# EAGLE design logoi_smd_gndpln v0.1 (EAGLE 9.0.0)
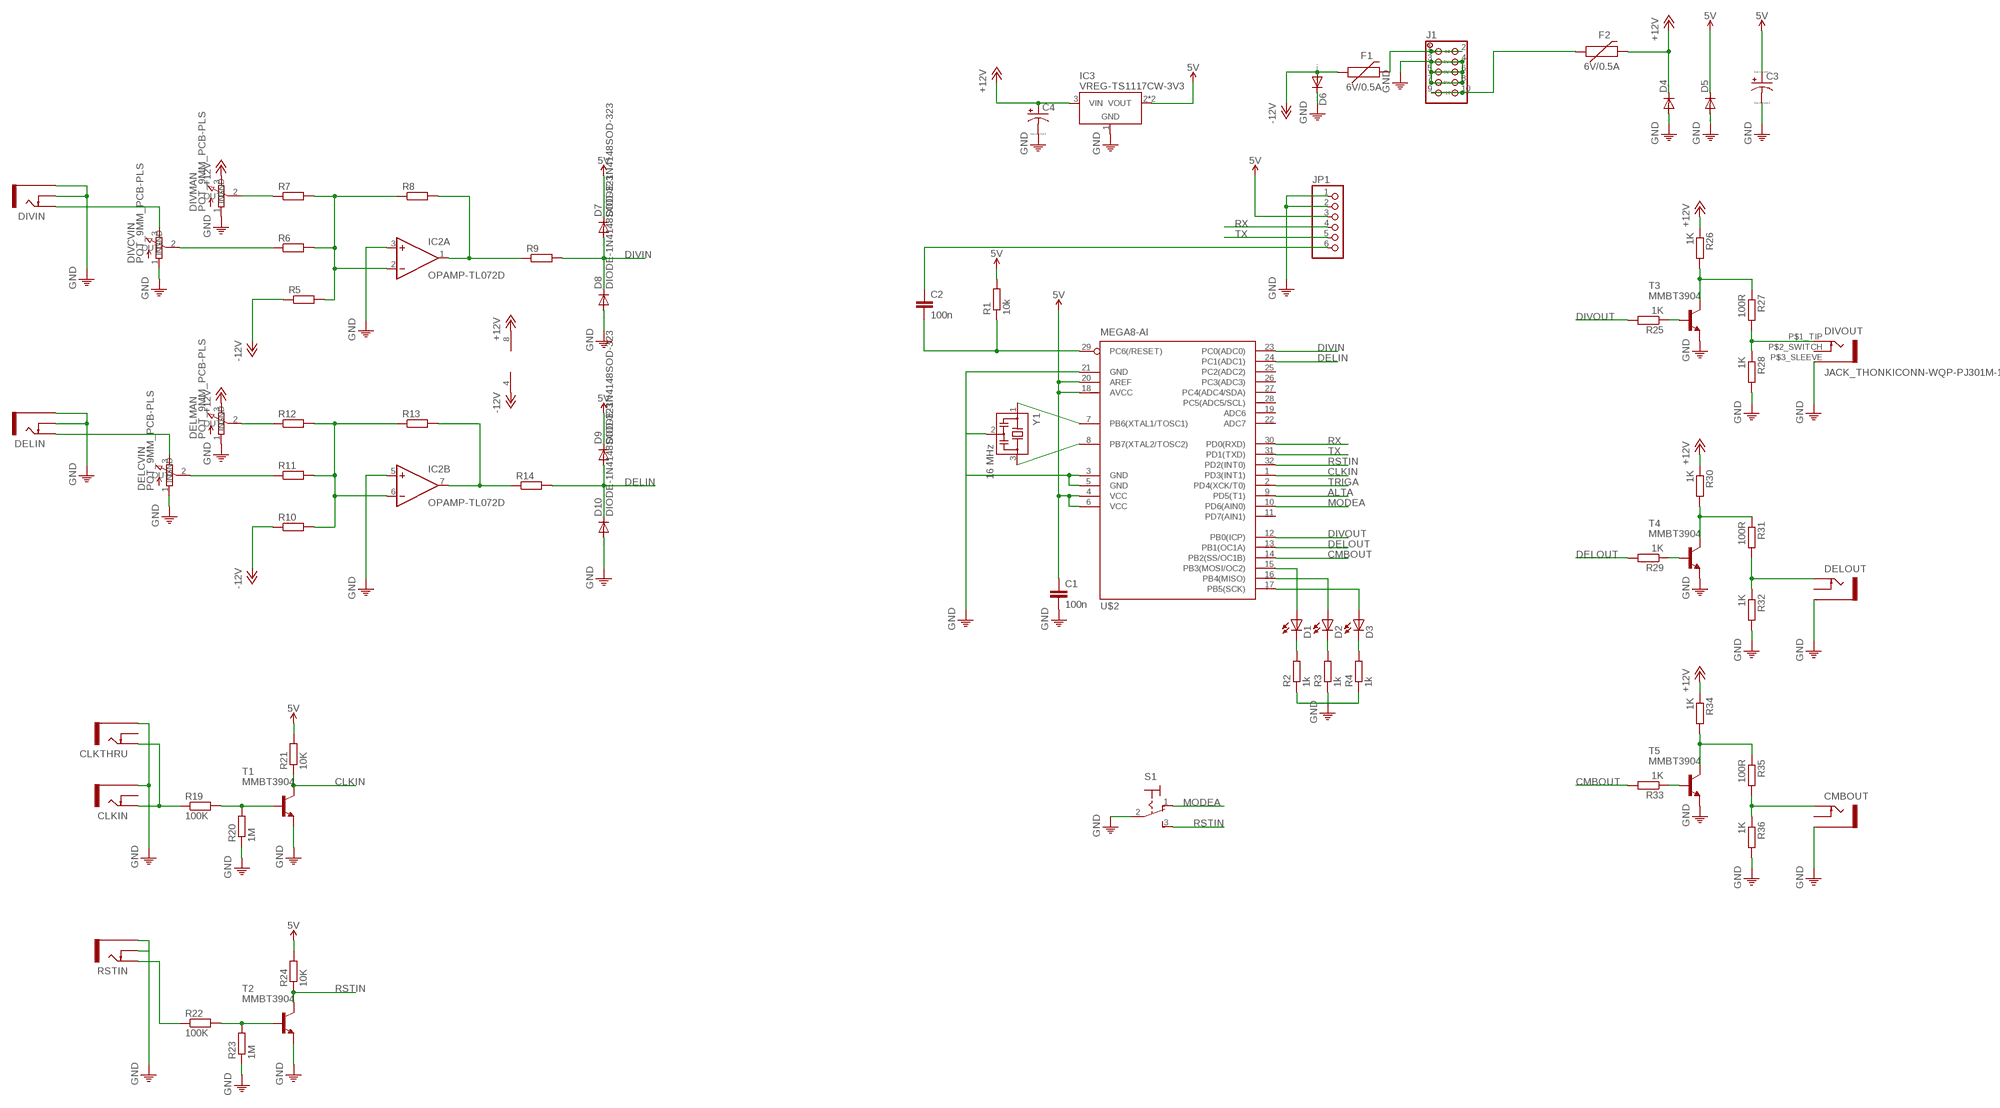
[diagram p0: schematic, sheet 1]

## Parts
C1  100n  CAPACITOR-EUC0603K  [C0603K]
C2  100n  CAPACITOR-EUC0603K  [C0603K]
C3  CAPACITOR_POLARIZED-USE2.5-5  [E2,5-5]
C4  CAPACITOR_POLARIZED-USE2.5-5  [E2,5-5]
CLKIN  JACK_THONKICONNNEW  [WQP-PJ301M-12_JACK]
CLKTHRU  JACK_THONKICONNNEW  [WQP-PJ301M-12_JACK]
CMBOUT  JACK_THONKICONNNEW  [WQP-PJ301M-12_JACK]
D1  LED3MM  [LED3MM]
D2  LED3MM  [LED3MM]
D3  LED3MM  [LED3MM]
D4  DIODE-DO-214AC  [DO-214AC]
D5  DIODE-DO-214AC  [DO-214AC]
D6  DIODE-DO-214AC  [DO-214AC]
D7  DIODE-1N4148SOD-323  [SOD323W_INFINEON]
D8  DIODE-1N4148SOD-323  [SOD323W_INFINEON]
D9  DIODE-1N4148SOD-323  [SOD323W_INFINEON]
D10  DIODE-1N4148SOD-323  [SOD323W_INFINEON]
DELCVIN  POT_9MM_PCB-PLS  [9MM_PLS]
DELIN  JACK_THONKICONNNEW  [WQP-PJ301M-12_JACK]
DELMAN  POT_9MM_PCB-PLS  [9MM_PLS]
DELOUT  JACK_THONKICONNNEW  [WQP-PJ301M-12_JACK]
DIVCVIN  POT_9MM_PCB-PLS  [9MM_PLS]
DIVIN  JACK_THONKICONNNEW  [WQP-PJ301M-12_JACK]
DIVMAN  POT_9MM_PCB-PLS  [9MM_PLS]
DIVOUT  JACK_THONKICONN-WQP-PJ301M-12  [WQP-PJ301M-12_JACK]
F1  6V/0.5A  FUSE-PPTC_HALF-AMP  [1206]
F2  6V/0.5A  FUSE-PPTC_HALF-AMP  [1206]
IC2  OPAMP-TL072D  [SO08]
IC3  VREG-TS1117CW-3V3  [SOT223]
J1  HEADER-EUROPWR_2X05-OPEN  [2X05_EUROPWR_OPEN]
JP1  PINHD-1X6  [1X06]
R1  10k  RESISTOR-EU_R0603  [R0603]
R2  1k  RESISTOR-EU_R0603  [R0603]
R3  1k  RESISTOR-EU_R0603  [R0603]
R4  1k  RESISTOR-EU_R0603  [R0603]
R5  RESISTOR-EU_R0603  [R0603]
R6  RESISTOR-EU_R0603  [R0603]
R7  RESISTOR-EU_R0603  [R0603]
R8  RESISTOR-EU_R0603  [R0603]
R9  RESISTOR-EU_R0603  [R0603]
R10  RESISTOR-EU_R0603  [R0603]
R11  RESISTOR-EU_R0603  [R0603]
R12  RESISTOR-EU_R0603  [R0603]
R13  RESISTOR-EU_R0603  [R0603]
R14  RESISTOR-EU_R0603  [R0603]
R19  100K  RESISTOR-EU_R0603  [R0603]
R20  1M  RESISTOR-EU_R0603  [R0603]
R21  10K  RESISTOR-EU_R0603  [R0603]
R22  100K  RESISTOR-EU_R0603  [R0603]
R23  1M  RESISTOR-EU_R0603  [R0603]
R24  10K  RESISTOR-EU_R0603  [R0603]
R25  1K  RESISTOR-EU_R0603  [R0603]
R26  1K  RESISTOR-EU_R0603  [R0603]
R27  100R  RESISTOR-EU_R0603  [R0603]
R28  1K  RESISTOR-EU_R0603  [R0603]
R29  1K  RESISTOR-EU_R0603  [R0603]
R30  1K  RESISTOR-EU_R0603  [R0603]
R31  100R  RESISTOR-EU_R0603  [R0603]
R32  1K  RESISTOR-EU_R0603  [R0603]
R33  1K  RESISTOR-EU_R0603  [R0603]
R34  1K  RESISTOR-EU_R0603  [R0603]
R35  100R  RESISTOR-EU_R0603  [R0603]
R36  1K  RESISTOR-EU_R0603  [R0603]
RSTIN  JACK_THONKICONNNEW  [WQP-PJ301M-12_JACK]
S1  SWITCH-SPDT-320-916  [320-916]
T1  MMBT3904  TRANSISTOR-NPN-MMBT3904LT1SOT23-BEC  [SOT23-BEC]
T2  MMBT3904  TRANSISTOR-NPN-MMBT3904LT1SOT23-BEC  [SOT23-BEC]
T3  MMBT3904  TRANSISTOR-NPN-MMBT3904LT1SOT23-BEC  [SOT23-BEC]
T4  MMBT3904  TRANSISTOR-NPN-MMBT3904LT1SOT23-BEC  [SOT23-BEC]
T5  MMBT3904  TRANSISTOR-NPN-MMBT3904LT1SOT23-BEC  [SOT23-BEC]
U$2  MEGA8-AI  [TQFP32-08]
Y1  16 MHz  CSTCR6M00G53Z  [CSTCR6M]

## Nets
5V: C1.1 C3.+ D5.C D7.C D9.C IC3.2(VOUT) IC3.4(VOUT) JP1.3 R1.2 R21.2 R24.2 U$2.4(VCC) U$2.6(VCC) U$2.18(AVCC) U$2.20(AREF)
+12V [GND]: C4.+ D4.C DELMAN.3(IN) DIVMAN.3(IN) F2.2 IC2.8(P:V+) IC3.3(VIN) R26.1 R30.1 R34.1
-12V: D6.A F1.1 IC2.4(P:V-) R5.1 R10.1
ALTA: U$2.9(PD5(T1))
CLKIN: R21.1 T1.C U$2.1(PD3(INT1))
CMBOUT: R33.2 U$2.14(PB2(SS/OC1B))
DELIN: D9.A D10.C R14.2 U$2.24(PC1(ADC1))
DELOUT: R29.2 U$2.13(PB1(OC1A))
DIVIN: D7.A D8.C R9.2 U$2.23(PC0(ADC0))
DIVOUT: R25.2 U$2.12(PB0(ICP))
MODEA: S1.1(O) U$2.10(PD6(AIN0))
N$1: U$2.7(PB6(XTAL1/TOSC1)) Y1.1
N$2: U$2.8(PB7(XTAL2/TOSC2)) Y1.3
N$3: F1.2 J1.1 J1.2
N$4: C2.2 R1.1 U$2.29(PC6(/RESET))
N$5: C2.1 JP1.6
N$7 [GND]: F2.1 J1.9 J1.10
N$9: IC2.2(A:-IN) R5.2 R6.2 R7.2 R8.1
N$10: IC2.1(A:OUT) R8.2 R9.1
N$12: R25.1 T3.B
N$13: IC2.6(B:-IN) R10.2 R11.2 R12.2 R13.1
N$14: R26.2 R27.1 T3.C
N$15: IC2.7(B:OUT) R13.2 R14.1
N$17: DIVOUT.P$1_TIP R27.2 R28.1
N$18: DIVCVIN.3(IN) DIVIN.P$1_TIP(TIP)
N$19: DIVCVIN.2(OUT) R6.1
N$20: DIVMAN.2(OUT) R7.1
N$21: D1.K(C) R2.2
N$22: D2.K(C) R3.2
N$23: D3.K(C) R4.2
N$24: D1.A U$2.15(PB3(MOSI/OC2))
N$25: D2.A U$2.16(PB4(MISO))
N$26: D3.A U$2.17(PB5(SCK))
N$27: DELCVIN.2(OUT) R11.1
N$28: DELCVIN.3(IN) DELIN.P$1_TIP(TIP)
N$29: DELMAN.2(OUT) R12.1
N$30: CLKIN.P$1_TIP(TIP) CLKTHRU.P$1_TIP(TIP) R19.1
N$31: R19.2 R20.2 T1.B
N$33: R22.1 RSTIN.P$1_TIP(TIP)
N$34: R22.2 R23.2 T2.B
N$35: R29.1 T4.B
N$36: R30.2 R31.1 T4.C
N$37: DELOUT.P$1_TIP(TIP) R31.2 R32.1
N$39: R33.1 T5.B
N$40: R34.2 R35.1 T5.C
N$41: CMBOUT.P$1_TIP(TIP) R35.2 R36.1
PE [GND]: C1.2 C3.- C4.- CLKIN.P$3_SLEEVE(SLEEVE) CLKTHRU.P$3_SLEEVE(SLEEVE) CMBOUT.P$3_SLEEVE(SLEEVE) D4.A D5.A D6.C D8.A D10.A DELCVIN.1(GND) DELIN.P$2_SWITCH(SWITCH) DELIN.P$3_SLEEVE(SLEEVE) DELMAN.1(GND) DELOUT.P$3_SLEEVE(SLEEVE) DIVCVIN.1(GND) DIVIN.P$2_SWITCH(SWITCH) DIVIN.P$3_SLEEVE(SLEEVE) DIVMAN.1(GND) DIVOUT.P$3_SLEEVE IC2.3(A:+IN) IC2.5(B:+IN) IC3.1(GND) J1.3 J1.4 J1.5 J1.6 J1.7 J1.8 JP1.1 JP1.2 R2.1 R3.1 R4.1 R20.1 R23.1 R28.2 R32.2 R36.2 RSTIN.P$2_SWITCH(SWITCH) RSTIN.P$3_SLEEVE(SLEEVE) S1.2(P) T1.E T2.E T3.E T4.E T5.E U$2.3(GND) U$2.5(GND) U$2.21(GND) Y1.2 ; supply symbol labelled GND
RSTIN: R24.1 S1.3(S) T2.C U$2.32(PD2(INT0))
RX: JP1.4 U$2.30(PD0(RXD))
TRIGA: U$2.2(PD4(XCK/T0))
TX: JP1.5 U$2.31(PD1(TXD))
Unconnected: CLKIN.P$2_SWITCH(SWITCH) CLKTHRU.P$2_SWITCH(SWITCH) CMBOUT.P$2_SWITCH(SWITCH) DELOUT.P$2_SWITCH(SWITCH) DIVOUT.P$2_SWITCH U$2.11(PD7(AIN1)) U$2.19(ADC6) U$2.22(ADC7) U$2.25(PC2(ADC2)) U$2.26(PC3(ADC3)) U$2.27(PC4(ADC4/SDA)) U$2.28(PC5(ADC5/SCL))

## Library data of the parts
C1 C2 = 0000-master:CAPACITOR-EU: CAPACITOR, European symbol
C3 C4 = 0000-master:CAPACITOR_POLARIZED-US: POLARIZED CAPACITOR, American symbol
CLKIN CLKTHRU CMBOUT DELIN DELOUT DIVIN RSTIN = 0000-master:JACK_THONKICONN: 3.5mm socket for Eurorack modular synths
D1-D3 = 0000-master:LED: LED OSRAM: - CHIPLED LG R971, LG N971, LY N971, LG Q971, LY Q971, LO R971, LY R971 LH N974, LH R974 LS Q976, LO Q976, LY Q976 LO Q996 - Hyper CHIPLED LW Q18S LB Q993, LB Q99A, LB R99A - SideLED LS A670, LO A670, LY A670, LG A670, LP A670 LB A673, LV A673, LT A673, LW A673 LH A674 LY A675 LS A676, LA A676, LO A676, LY A676, LW A676 LS A679, LY A679, LG A679 - Hyper Micro SIDELED® LS Y876, LA Y876, LO Y876, LY Y876 LT Y87S - SmartLED LW L88C, LW L88S LB L89C, LB L89S, LG L890 LS L89K, LO L89K, LY L89K LS L896, LA L896, LO L896, LY L896 - TOPLED LS T670, LO T670, LY T670, LG T670, LP T670 LSG T670, LSP T670, LSY T670, LOP T670, LYG T670 LG T671, LOG T671, LSG T671 LB T673, LV T673, LT T673, LW T673 LH T674 LS T676, LA T676, LO T676, LY T676, LB T676, LH T676, LSB T676, LW T676 LB T67C, LV T67C, LT T67C, LS T67K, LO T67K, LY T67K, LW E67C LS E67B, LA E67B, LO E67B, LY E67B, LB E67C, LV E67C, LT E67C LW T67C LS T679, LY T679, LG T679 LS T770, LO T770, LY T770, LG T770, LP T770 LB T773, LV T773, LT T773, LW T773 LH T774 LS E675, LA E675, LY E675, LS T675 LS T776, LA T776, LO T776, LY T776, LB T776 LHGB T686 LT T68C, LB T68C - Hyper Mini TOPLED® LB M676 - Mini TOPLED Santana® LG M470 LS M47K, LO M47K, LY M47K Source: http://www.osram.convergy.de LUXEON: - LUMILED® LXK2-PW12-R00, LXK2-PW12-S00, LXK2-PW14-U00, LXK2-PW14-V00 LXK2-PM12-R00, LXK2-PM12-S00, LXK2-PM14-U00 LXK2-PE12-Q00, LXK2-PE12-R00, LXK2-PE12-S00, LXK2-PE14-T00, LXK2-PE14-U00 LXK2-PB12-K00, LXK2-PB12-L00, LXK2-PB12-M00, LXK2-PB14-N00, LXK2-PB14-P00, LXK2-PB14-Q00 LXK2-PR12-L00, LXK2-PR12-M00, LXK2-PR14-Q00, LXK2-PR14-R00 LXK2-PD12-Q00, LXK2-PD12-R00, LXK2-PD12-S00 LXK2-PH12-R00, LXK2-PH12-S00 LXK2-PL12-P00, LXK2-PL12-Q00, LXK2-PL12-R00 Source: www.luxeon.com KINGBRIGHT: KA-3528ASYC Source: www.kingbright.com
D4-D6 = diode:DIODE-: DIODE
D7-D10 = 0000-master:DIODE-1N4148: DIODE high speed (Philips)
DELCVIN DELMAN DIVCVIN DIVMAN = 0000-master:POT_9MM_PCB: 9 mm Square Rotary Potentiometers Source: Panasonic
DIVOUT = 0000-master:JACK_THONKICONN-WQP-PJ301M-12
F1 F2 = 0000-master:FUSE-PPTC: Resettable Fuse PPTC Resettable Fuse. Really a sort of resistor with a polymeric positive temperature coefficient whose resistance increases dramatically with an increase in temperature. When heated by the power passing through the resistance rises causing the current to be limited, protecting the circuit. This is achieved by the transition of the polymer from a crystalline to an amorphous state where the conductive carbon separates breaking the conductive pathways found in the cool crystalline structure. When a PPTC cools back down it resumes conducting letting the circuit turn back on. SparkFun Products: SparkFun RedBoard - Programmed with Arduino <https://www.sparkfun.com/products/12757> Pro Micro - 5V/16MHz <https://www.sparkfun.com/products/12640> Arduino Pro 328 - 5V/16MHz <https://www.sparkfun.com/products/10915> MP3 Trigger <https://www.sparkfun.com/products/13720>; PROD_ID: RES-08585
IC2 = 0000-master:OPAMP-TL072: OP AMP
IC3 = we-power:VREG: Voltage Regulators (LDOs, Switching Converters...) LDOs Taiwan Semi TS1117 800mA max 15V - compatible On Semi NCP1117 1A max 20V - compatible Diodes AP2111H 0.6A max 6V (0.25V@0.6A) - compatible Diodes AP2114H 1A max 6V (0.45V@1A) Taiwan Semi TS9011 250mA max 12V - compatible Diodes AP2210 300mA max 15V - compatible Microchip MCP1700 250mA max 6.5V - compatible Microchip MCP1702 250mA max 13V - compatible Microchip MCP1703 250mA max 16V - compatible Microchip MCP1754 150mA max 16V Taiwan Semi TS5204 150mA max 16V (low noise) DC/DC Converter Modules Recom R-78Ex.x-1.0-W36 1A max 28V - compatible CUI V78xx-2000 2A max 18V Murata OKI-78SR-x.x/1.5-W36 1.5A max 36V
J1 = 0000-master:HEADER-EUROPWR_2X05: 2x05 pin header
JP1 = pinhead:PINHD-1X6: PIN HEADER
R1-R14 R19-R36 = 0000-master:RESISTOR-EU_: RESISTOR, European symbol
S1 = 0000-master:SWITCH-SPDT-320-916: TOGGLE SWITCH distributor RS Components
T1-T5 = 0000-master:TRANSISTOR-NPN-: NPN Transistror BF959 corrected 2008.03.06
U$2 = atmel:MEGA8: MICROCONTROLLER 8 Kbytes FLASH, 1 kbytes SRAM, 512 bytes EEPROM, USART, 6-channel 10 bit ADC, 2-channel 8 bit ADC Pin compatible with Atmega48, ATMega88, ATMega168 Source: avr.lbr; MPN: ATMEGA8-16AU; OC_FARNELL: 9171371; OC_NEWARK: 73M8863
Y1 = murata-filter:CSTCR: Resonator Source: murata.co.jp; MPN: CSTCR6M00G53-R0; OC_FARNELL: 1170434; OC_NEWARK: 25M8759

## Net classes
0 default: width 0.203 mm
1 GND: width 0.305 mm

## Board
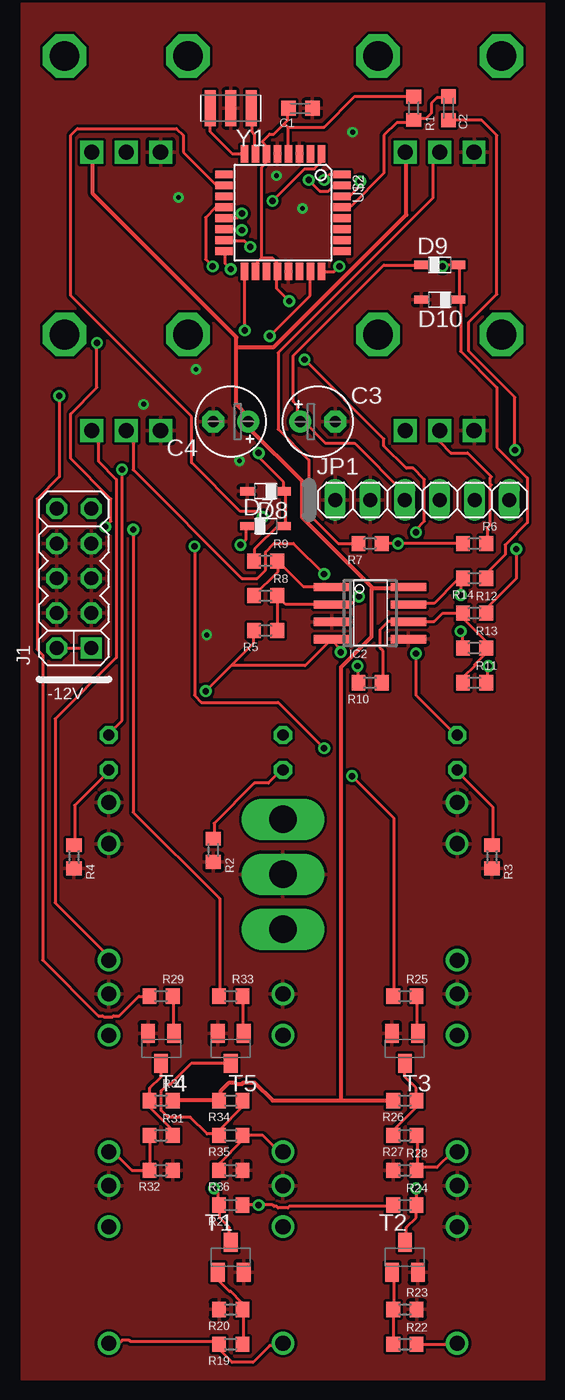
[diagram p1: board, top side]
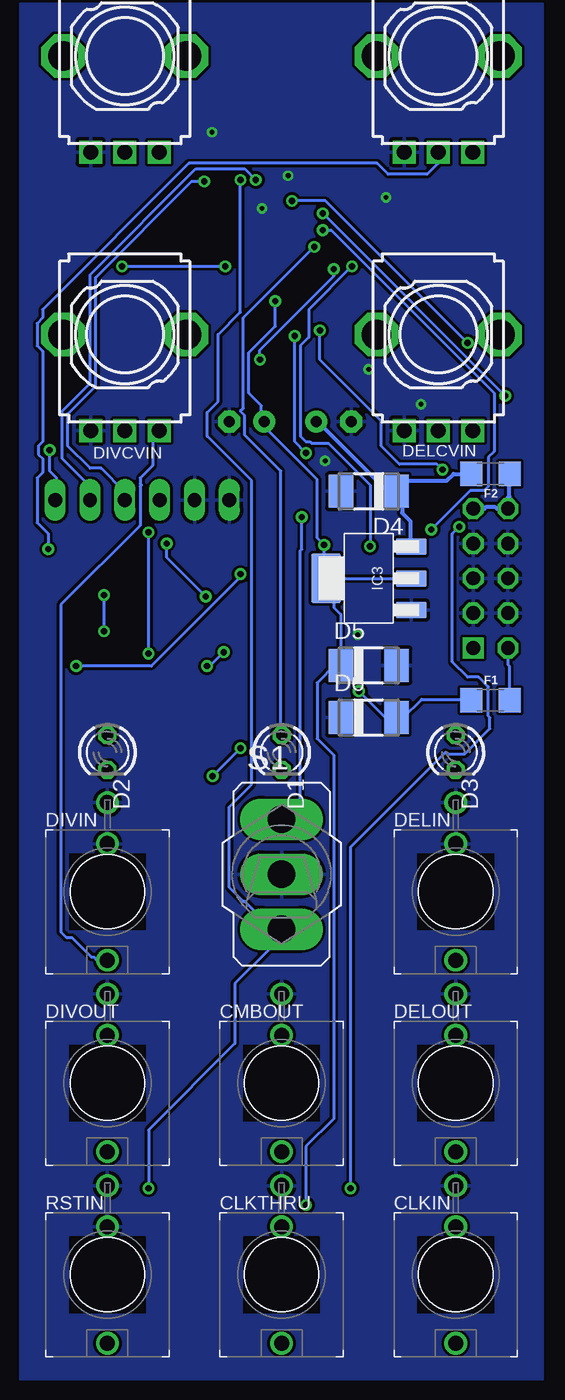
[diagram p2: board, bottom side, seen from below]

No outline drawn. Coordinates in mm, seen from the top.
Copper layers (1*16): Top 0.035mm / dielectric 1.5mm / Bottom 0.035mm
Design rules "default *": minimum track width 8mil, minimum drill 18mil, track to track 8mil, track to pad 8mil, pad to pad 8mil, via to via 8mil, smd to smd 8mil, copper to edge 40mil, drill to drill 8mil, minimum pad ring 10mil, minimum via ring 8mil, stop-mask expansion 4mil, vias tented up to drill 0mil, thermal gap 10mil

### Footprints (pad centres in the part's own frame; a part is rotated, then mirrored left to right if it is on the bottom)
C0603K = smd 1.05 x 1.08: 1 -0.875,0; 2 0.875,0
E2,5-5 = drill 0.813 pad 1.6: + -1.27,0 | drill 0.813 pad 1.6 octagon: - 1.27,0
WQP-PJ301M-12_JACK = drill 1.1: P$1_TIP 0,5; P$2_SWITCH 0,-3.5; P$3_SLEEVE 0,-6.5
LED3MM = drill 0.813 octagon: A -1.27,0; K 1.27,0
DO-214AC = smd 1.8 x 2.4: A 2.025,0; C -2.025,0
SOD323W_INFINEON = smd 1 x 0.6: A 1.35,0; C -1.35,0
9MM_PLS = drill 1.1 pad 1.676 square: 1 -2.5,-7; 2 0,-7; 3 2.5,-7 | drill 2.159 pad 3.175 octagon: M1 4.5,0; M2 -4.5,0
1206 = smd 1.6 x 1.8: 1 -1.4,0; 2 1.4,0
SO08 = smd 0.6 x 2.6: 1 -1.905,-2.8; 2 -0.635,-2.8; 3 0.635,-2.8; 4 1.905,-2.8; 5 1.905,2.8; 6 0.635,2.8; 7 -0.635,2.8; 8 -1.905,2.8
SOT223 = smd 2.235 x 1.219: 1 -3.099,2.311; 2 -3.099,0; 3 -3.099,-2.311 | smd 2.2 x 3.6: 4 3.099,0
2X05_EUROPWR_OPEN = drill 1.016 square: 1 -5.08,-1.27 | drill 1.016 octagon: 2 -5.08,1.27; 3 -2.54,-1.27; 4 -2.54,1.27; 5 0,-1.27; 6 0,1.27; 7 2.54,-1.27; 8 2.54,1.27; 9 5.08,-1.27; 10 5.08,1.27
1X06 = drill 1.016 long: 1 -6.35,0; 2 -3.81,0; 3 -1.27,0; 4 1.27,0; 5 3.81,0; 6 6.35,0
R0603 = smd 1 x 1.1: 1 -0.85,0; 2 0.85,0
320-916 = drill 2.007 long: 1 0,4.013; 2 0,0; 3 0,-4.013
SOT23-BEC = smd 1 x 1.4: B -0.95,-1.1; C 0,1.1; E 0.95,-1.1
TQFP32-08 = smd 1.27 x 0.559: 1 -4.293,2.8; 2 -4.293,2; 3 -4.293,1.2; 4 -4.293,0.4; 5 -4.293,-0.4; 6 -4.293,-1.2; 7 -4.293,-2; 8 -4.293,-2.8; 17 4.293,-2.8; 18 4.293,-2; 19 4.293,-1.2; 20 4.293,-0.4; 21 4.293,0.4; 22 4.293,1.2; 23 4.293,2; 24 4.293,2.8 | smd 0.559 x 1.27: 9 -2.8,-4.293; 10 -2,-4.293; 11 -1.2,-4.293; 12 -0.4,-4.293; 13 0.4,-4.293; 14 1.2,-4.293; 15 2,-4.293; 16 2.8,-4.293; 25 2.8,4.293; 26 2,4.293; 27 1.2,4.293; 28 0.4,4.293; 29 -0.4,4.293; 30 -1.2,4.293; 31 -2,4.293; 32 -2.8,4.293
CSTCR6M = smd 0.8 x 2.6: 1 -1.5,0; 2 0,0; 3 1.5,0

### Placement (x,y rotation side)
C1  20.32,92.71 0 top
C2  31.11,92.71 90 top
C3  21.59,69.85 0 top
C4  15.24,69.85 180 top
CLKIN  6.35,7.62 180 bottom
CLKTHRU  19.05,7.62 180 bottom
CMBOUT  19.05,21.59 180 bottom
D1  19.05,45.72 270 bottom
D2  31.75,45.72 270 bottom
D3  6.35,45.72 270 bottom
D4  12.7,64.77 180 bottom
D5  12.7,52.07 0 bottom
D6  12.7,48.26 0 bottom
D7  17.78,62.23 0 top
D8  17.78,64.77 180 top
D9  30.48,81.28 0 top
D10  30.48,78.74 180 top
DELCVIN  7.62,76.2 0 bottom
DELIN  6.35,35.56 180 bottom
DELMAN  7.62,96.52 0 bottom
DELOUT  6.35,21.59 180 bottom
DIVCVIN  30.48,76.2 0 bottom
DIVIN  31.75,35.56 180 bottom
DIVMAN  30.48,96.52 0 bottom
DIVOUT  31.75,21.59 180 bottom
F1  3.81,49.53 0 bottom
F2  3.81,66.04 180 bottom
IC2  25.4,55.88 270 top
IC3  12.7,58.42 180 bottom
J1  3.81,58.42 90 top
JP1  29.21,64.14 0 top
R1  28.57,92.71 90 top
R2  13.97,38.58 90 top
R3  34.29,38.1 90 top
R4  3.81,38.1 90 top
R5  17.78,54.61 0 top
R6  33.02,60.96 180 top
R7  25.4,60.96 0 top
R8  17.78,57.15 180 top
R9  17.78,59.69 180 top
R10  25.4,50.8 0 top
R11  33.02,50.8 180 top
R12  33.02,55.88 180 top
R13  33.02,53.34 180 top
R14  33.02,58.42 0 top
R19  15.24,2.54 0 top
R20  15.24,5.08 0 top
R21  15.24,12.7 0 top
R22  27.94,2.54 180 top
R23  27.94,5.08 180 top
R24  27.94,12.7 180 top
R25  27.94,27.94 180 top
R26  27.94,20.32 0 top
R27  27.94,17.78 0 top
R28  27.94,15.24 180 top
R29  10.16,27.94 180 top
R30  10.16,20.32 180 top
R31  10.16,17.78 180 top
R32  10.16,15.24 0 top
R33  15.24,27.94 180 top
R34  15.24,20.32 0 top
R35  15.24,17.78 0 top
R36  15.24,15.24 0 top
RSTIN  31.75,7.62 180 bottom
S1  19.05,36.83 0 bottom
T1  15.24,8.89 0 top
T2  27.94,8.89 0 top
T3  27.94,24.13 180 top
T4  10.16,24.13 180 top
T5  15.24,24.13 180 top
U$2  19.05,85.09 270 top
Y1  15.24,92.71 180 top

### Tracks (layer width: path | path; a pad name or v marks a point on that pad's centre or on a via)
5V  (via drill 0.46)
  Top 0.203: 17.48,81.79 17.07,81.38 17.07,80.87 U$2.18 | 17.48,81.79 18.29,81.79 18.69,81.38 18.69,80.87 U$2.20 18.59,80.77 18.59,79.55 v19.51,78.64 | 19.15,91.59 18.39,90.83 18.09,90.83 17.58,90.32 17.58,90.22 17.88,89.92 17.88,89.41 U$2.6 17.88,89.31 17.88,88.8 17.48,88.39 17.48,81.79 | 19.15,91.59 19.41,91.85 19.41,92.66 C1.1 | 19.41,91.34 22.05,91.34 24.28,93.57 28.55,93.57 R1.2 | 19.15,91.59 19.41,91.34 | 19.41,91.34 19.41,89.41 U$2.4 | D9.C 26.42,81.28 19.81,74.68 19.81,71.32 20.12,71.02 20.12,70.1 20.32,69.9 C3.+ 20.32,69.8 20.62,69.8 22.15,68.28 24.28,68.28 27.94,64.62 JP1.3 | R21.2 v17.27,12.7 18.29,12.7 18.39,12.6 18.59,12.6 18.69,12.5 19.41,12.5 19.51,12.6 26.92,12.6 27.03,12.7 R24.2 | v15.95,60.86 16.36,61.27 16.36,62.18 D7.C
  Bottom 0.203: v19.51,78.64 19.51,76.81 21.44,74.88 21.44,71.93 20.52,71.02 20.52,70.1 20.32,69.9 C3.+ 20.32,69.49 16.46,65.63 16.46,61.37 v15.95,60.86 15.95,58.52 15.85,58.42 IC3.4 | IC3.4 15.24,58.42 | 15.24,58.42 IC3.2 | 15.24,58.42 15.24,56.29 14.73,55.78 14.73,52.12 D5.C 14.83,52.12 15.14,52.12 16.46,50.8 16.46,46.74 15.24,45.52 15.24,19 17.27,16.97 v17.27,12.7 | 15.75,58.42 IC3.4
+12V
  Top 0.305: R30.1 R34.1 14.53,20.32 14.53,21.03 15.14,21.64 15.54,21.64 15.65,21.54 16.05,21.54 16.15,21.64 16.97,21.64 18.29,20.32 23.27,20.32 | 23.27,20.32 R26.1 | 25.6,57.71 28.14,57.71 IC2.8 | 25.6,57.71 20.42,62.89 20.42,65.53 16.56,69.39 16.56,69.8 C4.+ 16.46,69.9 16.46,70.31 15.65,71.12 15.65,75.29 | 15.65,75.29 15.65,76 5.18,86.46 5.18,89.51 DELMAN.3 | 15.65,75.29 18.39,75.29 28.04,84.94 28.04,89.51 DIVMAN.3 | 23.27,20.32 23.27,51.92 25.5,54.15 25.5,57.61 25.6,57.71
  Bottom 0.305: F2.2 6.5,66.04 7.01,65.53 9.96,65.53 10.67,64.82 D4.C | IC3.3 9.65,60.76 9.65,62.59 10.26,63.2 10.26,64.21 10.67,64.62 D4.C | D4.C 10.77,64.92 11.48,64.92 16.46,69.9 C4.+
-12V  (via drill 0.46)
  Top 0.203: 22.55,54.05 IC2.4 | v24.49,52.02 24.49,50.8 R10.1 | v23.27,53.03 23.27,53.24 22.55,53.95 IC2.4 | v13.41,50.19 15.27,52.05 | 15.27,52.05 16.93,53.71 R5.1 | IC2.4 20.67,52.05 15.27,52.05
  Bottom 0.203: F1.1 5.28,49.58 8.84,49.58 10.16,48.26 D6.A 11.48,48.26 v13.41,50.19 | v24.49,52.02 24.28,52.02 v23.27,53.03
CLKIN  (via drill 0.46)
  Top 0.203: T1.C 15.24,10.06 15.14,10.16 15.14,11.07 14.43,11.79 14.43,12.7 R21.1 14.33,12.7 14.33,13.61 v14.02,13.92 | v18.29,85.95 20.62,88.29 21.34,88.29 21.84,88.8 21.84,89.31 U$2.1 | v5.49,75.59 5.49,72.34 3.56,70.41 3.56,67.16 6.5,64.21 6.5,62.59 v6.1,62.18
  Bottom 0.203: v18.29,85.95 15.85,85.95 v5.49,75.59 | v6.1,62.18 6.6,61.67 6.6,52.32 5.49,51.21 4.67,51.21 3.96,50.49 3.96,48.36 3.86,48.26 3.86,47.45 5.69,45.62 7.01,45.62 7.11,45.72 14.02,38.81 v14.02,13.92
CMBOUT  (via drill 0.46)
  Top 0.203: v8.13,61.98 8.13,41.35 14.43,35.05 14.43,27.94 R33.2 | v16.05,83.82 15.95,83.92 14.83,83.92 U$2.14
  Bottom 0.203: v8.13,61.98 5.28,64.82 4.27,64.82 3.96,65.13 3.96,67.26 3.56,67.67 3.56,71.93 15.44,83.82 v16.05,83.82
DELIN  (via drill 0.46)
  Top 0.203: 31.9,78.74 31.9,81.28 D9.A 30.79,81.28 v30.68,81.18 | 31.9,78.74 32,78.64 32,74.98 34.65,72.34 34.65,67.97 36.88,65.73 36.88,62.48 35.26,60.86 35.26,60.15 33.93,58.83 33.93,58.42 R14.2 | 31.9,78.74 D10.C | v23.16,81.18 22.76,80.77 21.95,80.77 U$2.24
  Bottom 0.203: v30.68,81.18 v23.16,81.18
DELOUT  (via drill 0.46)
  Top 0.203: R29.2 8.53,27.94 7.11,26.52 6.71,26.52 6.6,26.42 5.99,26.42 5.89,26.52 5.59,26.52 1.52,30.58 1.52,52.83 1.12,53.24 1.12,64.21 2.74,65.84 v2.74,71.73 | v16.05,85.04 15.75,84.73 14.83,84.73 U$2.13
  Bottom 0.203: v16.05,85.04 v2.74,71.73
DIVIN  (via drill 0.46)
  Top 0.203: R9.2 16.97,59.74 16.97,60.55 18.69,62.28 19.1,62.28 D7.A 19.2,62.28 19.2,64.72 D8.C 19.1,64.82 19.1,65.43 17.27,67.26 v17.27,67.56 | v18.09,76.1 21.03,79.05 21.03,80.77 U$2.23
  Bottom 0.203: v18.09,76.1 18.09,68.38 v17.27,67.56
DIVOUT  (via drill 0.46)
  Top 0.203: v24.08,43.99 27.13,40.95 27.13,27.94 R25.2 | v22.05,46.02 18.69,49.38 13.11,49.38 12.6,49.89 v12.6,60.76 | v13.92,81.18 13.41,81.69 13.41,84.73 14.12,85.45 14.73,85.45 U$2.12
  Bottom 0.203: v22.05,46.02 v24.08,43.99 | v12.6,60.76 12.6,65.23 15.65,68.28 16.87,68.28 16.97,68.38 17.27,68.38 17.68,68.78 17.68,75.39 17.07,76 17.07,78.03 v13.92,81.18
MODEA  (via drill 0.46)
  Top 0.203: v17.58,62.89 17.17,63.3 15.95,63.3 12.39,66.85 12.39,70.21 3.56,79.05 3.56,90.73 4.06,91.24 11.28,91.24 11.79,90.73 11.79,89.51 14.12,87.17 14.73,87.17 U$2.10
  Bottom 0.203: v17.58,62.89 17.58,60.55 17.68,60.45 17.68,42.16 19,40.84 S1.1
N$1
  Top 0.203: U$2.7 16.97,89.41 16.97,90.83 16.76,91.03 16.76,92.66 Y1.1
N$2
  Top 0.203: U$2.8 16.15,89.41 15.34,89.41 13.72,91.03 13.72,92.66 Y1.3
N$3
  Top 0.203: J1.2 J1.1
  Bottom 0.203: J1.2 2.54,52.12 2.44,52.02 2.44,49.58 F1.2
N$4
  Top 0.203: C2.2 31.09,93.47 30.28,93.47 29.87,93.07 29.87,92.35 29.46,91.95 28.65,91.95 R1.1 28.55,91.85 28.35,91.64 27.33,91.64 26.42,90.73 26.42,87.99 23.98,85.55 23.37,85.55 U$2.29
N$5  (via drill 0.46)
  Top 0.203: v35.97,67.77 35.97,71.63 32.61,74.98 32.61,77.11 34.65,79.15 34.65,90.73 33.53,91.85 31.19,91.85 C2.1
  Bottom 0.203: v35.97,67.77 35.97,66.24 35.46,65.73 35.46,64.31 35.56,64.21 JP1.6
N$7
  Bottom 0.305: F2.1 2.44,66.04 2.44,64.41 2.54,64.31 J1.10 3.35,63.5 3.45,63.6 4.17,63.6 4.27,63.5 J1.9
N$9  (via drill 0.46)
  Top 0.203: R6.2 v27.43,60.96 R7.2 | 22.55,56.49 IC2.2 | v24.59,57.1 24.08,56.59 22.66,56.59 IC2.2 | R5.2 R8.1 19.27,56.52 IC2.2
  Bottom 0.203: v27.43,60.96 27.43,59.94 v24.59,57.1
N$10
  Top 0.203: 18.69,59.64 R9.1 | 22.55,57.81 IC2.1 20.55,57.78 18.69,59.64 | R8.2 18.69,58.91 18.69,59.64
N$12
  Top 0.203: R25.1 28.85,27.94 28.85,25.3 T3.B
N$13
  Top 0.203: 33.83,53.34 33.83,52.93 33.02,52.12 33.02,52.02 32.21,51.21 32.21,50.8 R11.2 | 33.83,53.34 33.83,53.85 32.21,55.47 32.21,55.88 R12.2 30.68,55.88 30.07,55.27 28.25,55.27 IC2.6 28.14,55.27 26.72,55.27 26.11,54.66 26.11,53.34 26.31,53.14 26.31,50.8 R10.2 | 33.83,53.34 R13.1
N$14
  Top 0.203: 28.75,20.32 28.75,19.81 27.13,18.19 27.13,17.78 R27.1 | T3.C 27.94,22.05 28.75,21.23 28.75,20.32 | 28.75,20.32 R26.2
N$15  (via drill 0.46)
  Top 0.203: v32,54.56 32.11,54.46 32.11,53.34 R13.2 | 32,58.22 32,58.32 32.11,58.42 R14.1 32,58.22 | 32,58.22 v32,57.2 | 32,58.22 31.7,58.22 30.07,56.59 28.25,56.59 IC2.7
  Bottom 0.203: v32,57.2 v32,54.56
N$17
  Top 0.203: 28.85,15.44 28.85,17.78 R27.2 | 28.85,15.44 28.85,15.24 R28.1 28.85,15.44 | 28.85,15.44 30.28,15.44 31.39,16.56 31.7,16.56 DIVOUT.P$1_TIP
N$18
  Bottom 0.203: DIVIN.P$1_TIP 31.8,30.58 32.51,30.58 32.72,30.79 32.92,30.79 34.34,32.21 34.75,32.21 35.15,32.61 35.15,56.49 29.36,62.28 29.36,65.13 29.26,65.23 29.36,65.33 29.36,65.73 28.45,66.65 28.45,68.78 28.04,69.19 DIVCVIN.3
N$19
  Top 0.203: DIVCVIN.2 30.48,68.38 31.29,67.56 32.51,67.56 34.24,65.84 34.14,65.73 34.14,65.33 34.24,65.23 34.14,65.13 34.14,62.28 33.93,62.08 33.93,60.96 R6.1
N$20
  Top 0.203: R7.1 23.06,60.96 20.93,63.09 20.93,67.06 18.69,69.29 18.69,74.88 29.97,86.16 29.97,89 DIVMAN.2
N$21
  Top 0.203: R2.2 14.02,39.52 14.02,40.54 16.97,43.48 17.98,43.48 19,44.5 D1.K
N$22
  Top 0.203: R3.2 34.34,39.01 34.34,41.76 31.7,44.4 D2.K
N$23
  Top 0.203: R4.2 3.86,39.01 3.86,41.86 6.4,44.4 D3.K
N$24  (via drill 0.46)
  Top 0.203: v16.66,82.6 16.26,83.01 14.83,83.01 U$2.15
  Bottom 0.203: v16.66,82.6 21.84,77.42 21.84,70.81 22.05,70.61 21.74,70.31 21.74,68.89 19.1,66.24 19.1,47.04 D1.A
N$25  (via drill 0.46)
  Top 0.203: v15.24,80.97 14.83,81.38 14.83,82.19 U$2.16 | v20.62,74.37 26.42,68.58 26.42,68.07 28.04,66.45 28.55,66.45 29.36,65.63 29.36,62.59 28.75,61.98 v28.75,61.77 | v28.75,52.93 28.75,49.89 31.7,46.94 D2.A
  Bottom 0.203: v15.24,80.97 15.24,80.47 20.62,75.08 v20.62,74.37 | v28.75,52.93 v28.75,61.77
N$26  (via drill 0.46)
  Top 0.203: v16.26,76.5 16.26,80.77 U$2.17 | v7.32,66.34 7.32,48.06 6.3,47.04 D3.A
  Bottom 0.203: v16.26,76.5 16.26,74.37 11.79,69.9 11.79,68.07 10.46,66.75 7.72,66.75 v7.32,66.34
N$27  (via drill 0.46)
  Top 0.203: v34.04,52.02 33.93,51.92 33.93,50.8 R11.1 | v22.05,58.73 19.81,60.96 18.39,60.96 17.78,60.35 17.78,59.03 17.17,58.42 16.05,58.42 8.13,66.34 8.13,68.68 DELCVIN.2
  Bottom 0.203: v34.04,52.02 28.55,52.02 22.05,58.52 v22.05,58.73
N$28
  Top 0.203: DELIN.P$1_TIP 6.3,30.58 6.3,30.89 2.44,34.75 2.44,48.16 6.91,52.63 6.91,65.63 5.59,66.95 5.59,68.78 5.18,69.19 DELCVIN.3
N$29  (via drill 0.46)
  Top 0.203: v36.07,60.55 36.07,58.42 33.93,56.29 33.93,55.88 R12.1
  Bottom 0.203: v36.07,60.55 36.07,61.67 36.88,62.48 36.88,65.73 36.47,66.14 36.47,67.16 36.78,67.46 36.78,68.07 36.47,68.38 36.47,74.98 36.88,75.39 36.88,77.01 36.47,77.42 36.47,78.03 25.81,88.7 12.09,88.7 11.28,87.88 8.43,87.88 7.62,88.7 DELMAN.2
N$30
  Top 0.203: CLKTHRU.P$1_TIP 19,2.54 18.9,2.44 18.09,2.44 16.87,1.22 15.34,1.22 14.43,2.13 14.43,2.54 R19.1 14.33,2.54 14.12,2.74 7.92,2.74 7.82,2.85 7.32,2.85 7.11,2.64 6.4,2.64 CLKIN.P$1_TIP
N$31
  Top 0.203: R19.2 16.15,2.54 16.15,5.08 R20.2 16.05,5.08 16.05,5.59 15.24,6.4 15.14,6.4 14.33,7.21 14.33,7.72 T1.B
N$33
  Top 0.203: R22.1 31.67,2.54 RSTIN.P$1_TIP
N$34
  Top 0.203: 27.13,5.08 27.13,7.62 27.03,7.72 T2.B | 27.13,5.08 27.13,4.57 | 27.13,5.08 R23.2 R22.2
N$35
  Top 0.203: R29.1 11.07,27.94 11.07,25.3 T4.B
N$36
  Top 0.203: 9.35,20.32 9.35,19.81 10.97,18.19 10.97,17.78 R31.1 | T4.C 10.16,22.05 9.35,21.23 9.35,20.32 | 9.35,20.32 R30.2
N$37
  Top 0.203: R31.2 9.35,17.78 9.35,15.24 R32.1 8.03,15.24 6.71,16.56 6.4,16.56 DELOUT.P$1_TIP
N$39
  Top 0.203: R33.1 16.15,27.94 16.15,25.3 T5.B
N$40
  Top 0.203: 14.43,17.88 14.43,18.19 16.05,19.81 16.05,20.32 R34.2 | 14.43,17.88 14.43,17.78 R35.1 14.43,17.88 | 14.43,17.88 13.51,17.88 12.29,19.1 10.67,19.1 10.16,19.61 10.16,21.03 10.67,21.54 10.87,21.54 12.39,23.06 15.24,23.06 T5.C
N$41
  Top 0.203: R36.1 14.43,15.24 14.43,15.75 16.05,17.37 16.05,17.78 R35.2 17.58,17.78 18.69,16.66 19,16.66 CMBOUT.P$1_TIP
PE  (via drill 0.35)
  other vias: 11.43,86.2 18.57,87.79 20.48,85.41 24.13,90.96 8.89,71.12 12.7,73.66 15.88,66.99 13.49,54.29
  pour Top: 0,0 38.1,0 38.1,100.33 0,100.33
  pour Bottom: 0,0 38.1,0 38.1,100.33 0,100.33
RSTIN  (via drill 0.46)
  Top 0.203: 28.75,12.7 28.75,11.79 28.04,11.07 28.04,10.16 27.94,10.06 T2.C | v22.05,87.48 22.45,87.88 23.27,87.88 U$2.32 | v28.75,13.92 28.75,12.7 | 28.75,12.7 R24.1
  Bottom 0.203: v22.05,87.48 22.05,77.83 23.67,76.2 23.67,71.32 24.49,70.51 24.49,68.78 21.23,65.53 21.23,43.38 22.86,41.76 22.86,35.87 21.84,34.85 21.74,34.85 19.71,32.82 S1.3 19.81,32.82 19.81,31.5 22.45,28.85 22.45,24.49 28.75,18.19 v28.75,13.92
RX  (via drill 0.46)
  Top 0.203: v24.69,87.38 24.69,87.07 23.98,86.36 23.37,86.36 U$2.30
  Bottom 0.203: v24.69,87.38 25.6,87.38 32.61,80.37 32.61,72.44 34.65,70.41 34.65,68.07 33.02,66.45 32.21,66.45 30.48,64.72 JP1.4
TX  (via drill 0.46)
  Top 0.203: v20.93,87.48 21.74,86.67 22.35,86.67 22.76,87.07 23.27,87.07 U$2.31
  Bottom 0.203: v20.93,87.48 21.74,88.29 25.3,88.29 33.02,80.57 33.02,72.64 35.05,70.61 35.05,67.16 33.02,65.13 JP1.5

### Text on the board
tDocu: Rebel Tech Logoi
bDocu: F2 | D4 | D5 | D6 | F1